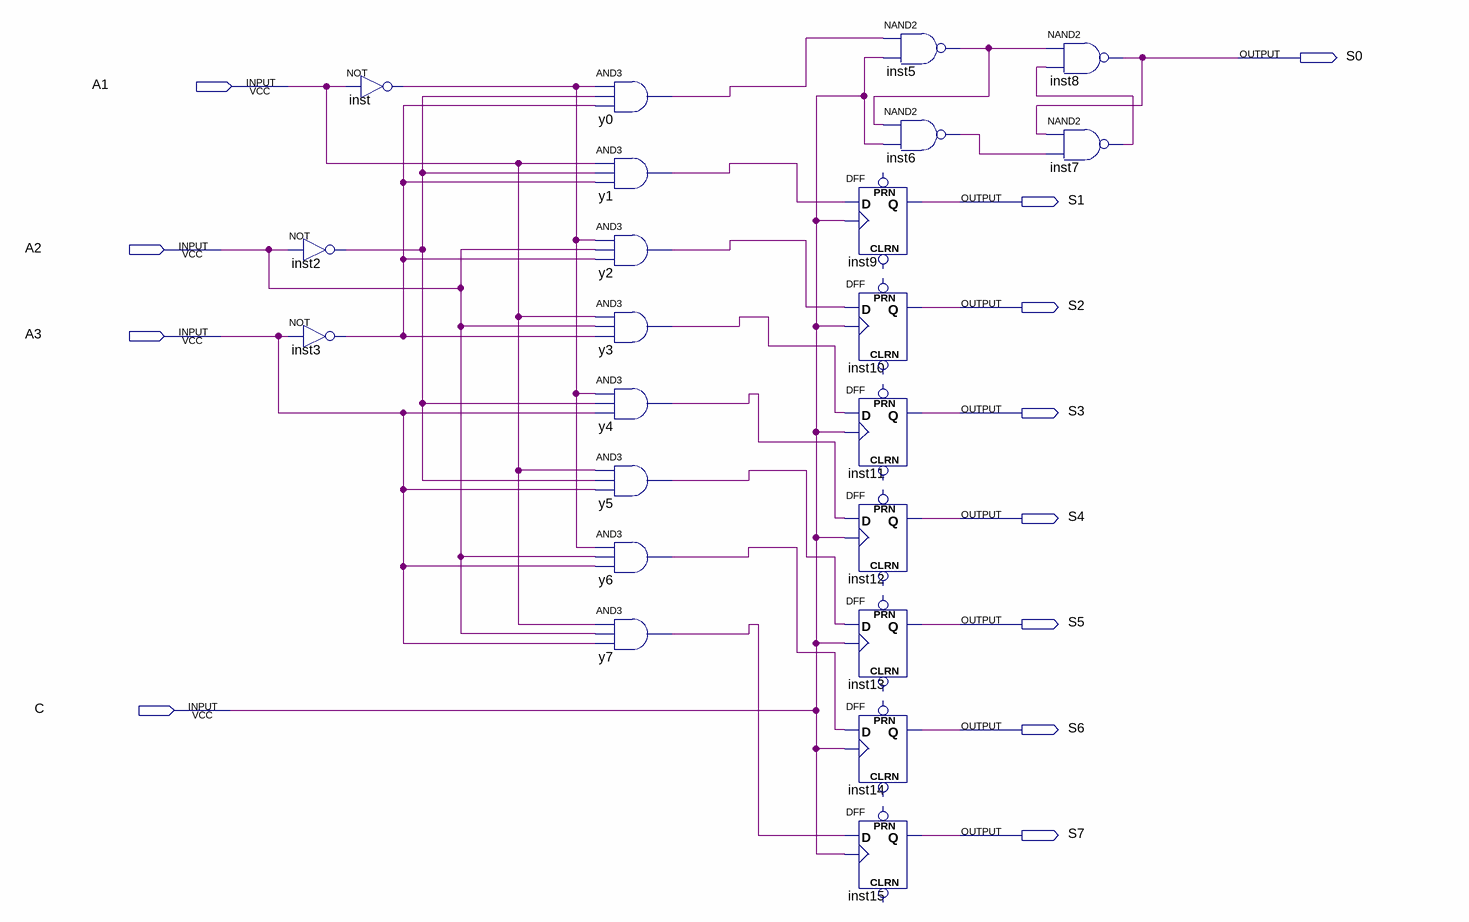
[diagram p0: schematic sheet]
// Quartus schematic Lab1.bdf as structural Verilog: 22 symbols, 12 pins
module Lab1 (
  input  A1,
  input  A2,
  input  A3,
  input  C,
  output S0,
  output S1,
  output S2,
  output S3,
  output S4,
  output S5,
  output S6,
  output S7
);

  wire inst2_out, inst3_out, inst5_out, inst6_out, inst7_out, inst_out, y0_out, y1_out, y2_out, y3_out,
       y4_out, y5_out, y6_out, y7_out;

  not inst2 (inst2_out, A2);
  not inst3 (inst3_out, A3);
  not inst (inst_out, A1);
  and y0 (y0_out, inst_out, inst2_out, inst3_out);
  and y1 (y1_out, A1, inst2_out, inst3_out);
  and y2 (y2_out, inst_out, A2, inst3_out);
  and y3 (y3_out, A1, A2, inst3_out);
  and y4 (y4_out, inst_out, inst2_out, A3);
  and y5 (y5_out, A1, inst2_out, A3);
  and y6 (y6_out, inst_out, A2, A3);
  and y7 (y7_out, A1, A2, A3);
  DFF inst9 (.CLK(C), .D(y1_out), .Q(S1));  // open: CLRN, PRN
  DFF inst10 (.CLK(C), .D(y2_out), .Q(S2));  // open: CLRN, PRN
  DFF inst11 (.CLK(C), .D(y3_out), .Q(S3));  // open: CLRN, PRN
  DFF inst12 (.CLK(C), .D(y4_out), .Q(S4));  // open: CLRN, PRN
  DFF inst13 (.CLK(C), .D(y5_out), .Q(S5));  // open: CLRN, PRN
  DFF inst14 (.CLK(C), .D(y6_out), .Q(S6));  // open: CLRN, PRN
  DFF inst15 (.CLK(C), .D(y7_out), .Q(S7));  // open: CLRN, PRN
  nand inst5 (inst5_out, y0_out, C);
  nand inst6 (inst6_out, inst5_out, C);
  nand inst8 (S0, inst5_out, inst7_out);
  nand inst7 (inst7_out, S0, inst6_out);
endmodule
